# EAGLE design droneMaster (EAGLE 9.0.0)
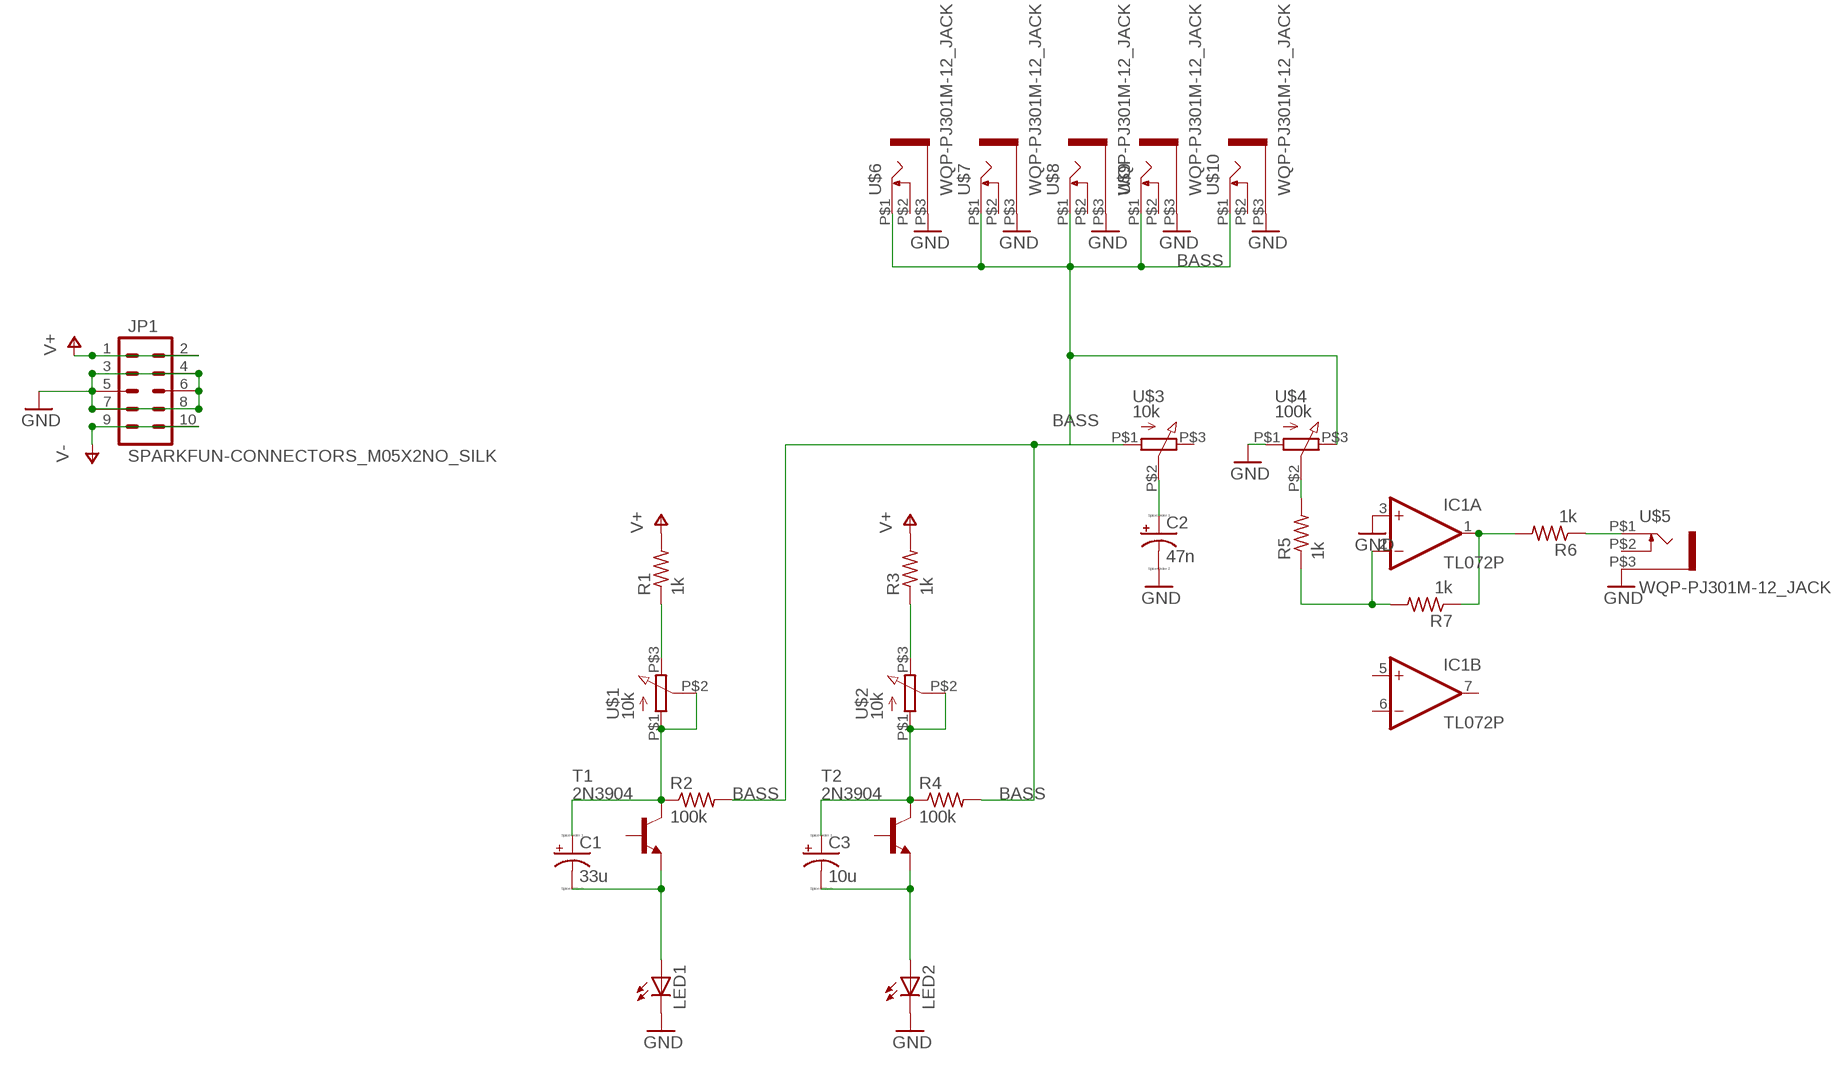
[diagram p0: schematic, sheet 1]

## Parts
C1  33u  CPOL-USE2.5-7  [E2,5-7]
C2  47n  CPOL-USE2.5-7  [E2,5-7]
C3  10u  CPOL-USE2.5-7  [E2,5-7]
IC1  TL072P  [DIL08]
JP1  SPARKFUN-CONNECTORS_M05X2NO_SILK  [SPARKFUN-CONNECTORS_2X5_NOSILK]
LED1  LED5MM  [LED5MM]
LED2  LED5MM  [LED5MM]
R1  1k  R-US_0204/7  [0204/7]
R2  100k  R-US_0204/7  [0204/7]
R3  1k  R-US_0204/7  [0204/7]
R4  100k  R-US_0204/7  [0204/7]
R5  1k  R-US_0204/7  [0204/7]
R6  1k  R-US_0204/7  [0204/7]
R7  1k  R-US_0204/7  [0204/7]
T1  2N3904  [TO92]
T2  2N3904  [TO92]
U$1  10k  INSTRUO_Q-POT  [INSTRUO_Q-POT]
U$2  10k  INSTRUO_Q-POT  [INSTRUO_Q-POT]
U$3  10k  INSTRUO_Q-POT  [INSTRUO_Q-POT]
U$4  100k  INSTRUO_Q-POT  [INSTRUO_Q-POT]
U$5  WQP-PJ301M-12_JACK  [WQP-PJ301M-12_JACK]
U$6  WQP-PJ301M-12_JACK  [WQP-PJ301M-12_JACK]
U$7  WQP-PJ301M-12_JACK  [WQP-PJ301M-12_JACK]
U$8  WQP-PJ301M-12_JACK  [WQP-PJ301M-12_JACK]
U$9  WQP-PJ301M-12_JACK  [WQP-PJ301M-12_JACK]
U$10  WQP-PJ301M-12_JACK  [WQP-PJ301M-12_JACK]

## Nets
BASS: R2.2 R4.2 U$3.P$1 U$4.P$3 U$6.P$1 U$7.P$1 U$8.P$1 U$9.P$1 U$10.P$1
GND: C2.- IC1.3(A:+IN) JP1.3 JP1.4 JP1.5 JP1.6 JP1.7 JP1.8 LED1.K(C) LED2.K(C) U$4.P$1 U$5.P$3 U$6.P$3 U$7.P$3 U$8.P$3 U$9.P$3 U$10.P$3
N$1: R1.1 U$1.P$3
N$2: C1.+ R2.1 T1.1(C) U$1.P$1 U$1.P$2
N$3: C1.- LED1.A T1.3(E)
N$5: R3.1 U$2.P$3
N$6: C3.+ R4.1 T2.1(C) U$2.P$1 U$2.P$2
N$7: C3.- LED2.A T2.3(E)
N$8: C2.+ U$3.P$2
N$9: R5.2 U$4.P$2
N$10: IC1.1(A:OUT) R6.2 R7.1
N$11: IC1.2(A:-IN) R5.1 R7.2
N$12: R6.1 U$5.P$1
V+: JP1.1 JP1.2 R1.2 R3.2
V-: JP1.9 JP1.10
Unconnected: IC1.5(B:+IN) IC1.6(B:-IN) IC1.7(B:OUT) T1.2(B) T2.2(B) U$3.P$3 U$5.P$2 U$6.P$2 U$7.P$2 U$8.P$2 U$9.P$2 U$10.P$2

## Power pins joined to a net without a drawn wire
V+: IC1.8(P:V+)
V-: IC1.4(P:V-)

## Library data of the parts
C1-C3 = resistor:CPOL-US: POLARIZED CAPACITOR, American symbol
IC1 = linear:TL072: OP AMP
JP1 = Pure_VCO_SMD_V2_2:SPARKFUN-CONNECTORS_M05X2: Header 5x2 Standard 10-pin dual row 0.1" header. Commonly used with AVR-ISP. Use with Spark Fun Electronics SKU: PRT-00778
LED1 LED2 = led:LED: LED OSRAM: - CHIPLED LG R971, LG N971, LY N971, LG Q971, LY Q971, LO R971, LY R971 LH N974, LH R974 LS Q976, LO Q976, LY Q976 LO Q996 - Hyper CHIPLED LW Q18S LB Q993, LB Q99A, LB R99A - SideLED LS A670, LO A670, LY A670, LG A670, LP A670 LB A673, LV A673, LT A673, LW A673 LH A674 LY A675 LS A676, LA A676, LO A676, LY A676, LW A676 LS A679, LY A679, LG A679 - Hyper Micro SIDELED® LS Y876, LA Y876, LO Y876, LY Y876 LT Y87S - SmartLED LW L88C, LW L88S LB L89C, LB L89S, LG L890 LS L89K, LO L89K, LY L89K LS L896, LA L896, LO L896, LY L896 - TOPLED LS T670, LO T670, LY T670, LG T670, LP T670 LSG T670, LSP T670, LSY T670, LOP T670, LYG T670 LG T671, LOG T671, LSG T671 LB T673, LV T673, LT T673, LW T673 LH T674 LS T676, LA T676, LO T676, LY T676, LB T676, LH T676, LSB T676, LW T676 LB T67C, LV T67C, LT T67C, LS T67K, LO T67K, LY T67K, LW E67C LS E67B, LA E67B, LO E67B, LY E67B, LB E67C, LV E67C, LT E67C LW T67C LS T679, LY T679, LG T679 LS T770, LO T770, LY T770, LG T770, LP T770 LB T773, LV T773, LT T773, LW T773 LH T774 LS E675, LA E675, LY E675, LS T675 LS T776, LA T776, LO T776, LY T776, LB T776 LHGB T686 LT T68C, LB T68C - Hyper Mini TOPLED® LB M676 - Mini TOPLED Santana® LG M470 LS M47K, LO M47K, LY M47K Source: http://www.osram.convergy.de LUXEON: - LUMILED® LXK2-PW12-R00, LXK2-PW12-S00, LXK2-PW14-U00, LXK2-PW14-V00 LXK2-PM12-R00, LXK2-PM12-S00, LXK2-PM14-U00 LXK2-PE12-Q00, LXK2-PE12-R00, LXK2-PE12-S00, LXK2-PE14-T00, LXK2-PE14-U00 LXK2-PB12-K00, LXK2-PB12-L00, LXK2-PB12-M00, LXK2-PB14-N00, LXK2-PB14-P00, LXK2-PB14-Q00 LXK2-PR12-L00, LXK2-PR12-M00, LXK2-PR14-Q00, LXK2-PR14-R00 LXK2-PD12-Q00, LXK2-PD12-R00, LXK2-PD12-S00 LXK2-PH12-R00, LXK2-PH12-S00 LXK2-PL12-P00, LXK2-PL12-Q00, LXK2-PL12-R00 Source: www.luxeon.com KINGBRIGHT: KA-3528ASYC Source: www.kingbright.com
R1-R7 = resistor:R-US_: RESISTOR, American symbol
T1 T2 = transistor:2N3904: NPN TRANSISTOR
U$1-U$4 = Pure_VCO_SMD_V2_2:INSTRUO_Q-POT
U$5-U$10 = thonkiconn:WQP-PJ301M-12_JACK

## Board
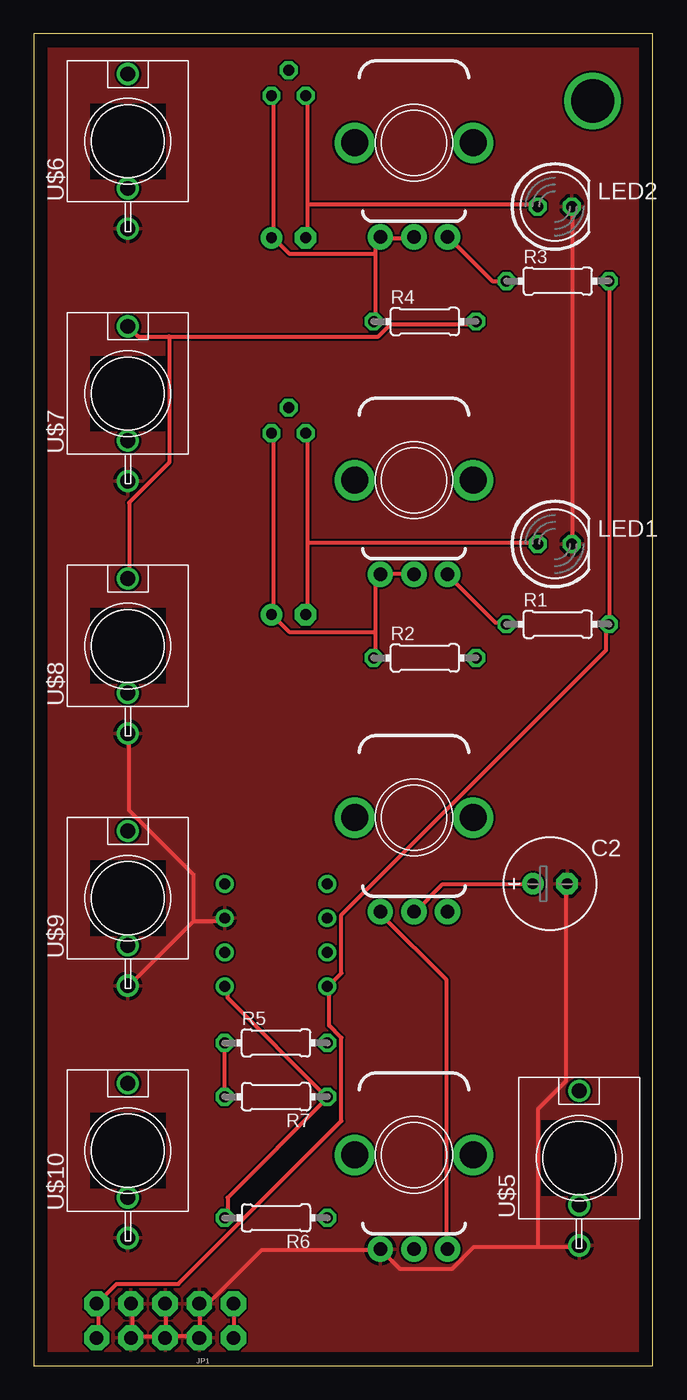
[diagram p1: board, top side]
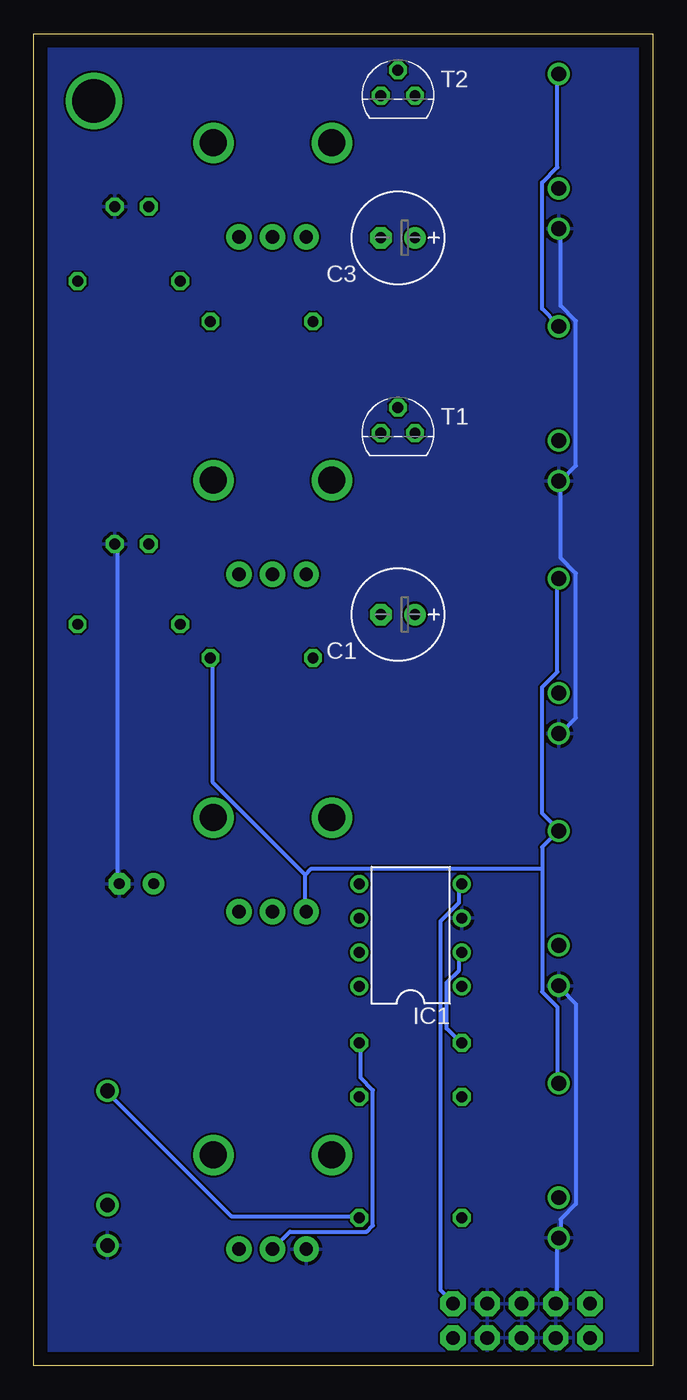
[diagram p2: board, bottom side, seen from below]

Size 46 x 99 mm. Coordinates in mm from the lower left corner, seen from the top.
Outline: 0,0 46,0 46,99 0,99 0,0
Copper layers (1*16): Top 0.035mm / dielectric 1.5mm / Bottom 0.035mm
Design rules "default *": minimum track width 12mil, minimum drill 0.35mm, track to track 6mil, track to pad 6mil, pad to pad 6mil, via to via 6mil, smd to smd 6mil, copper to edge 40mil, drill to drill 6mil, minimum pad ring 10mil, minimum via ring 8mil, stop-mask expansion 4mil, vias tented up to drill 0mil, thermal gap 10mil

### Footprints (pad centres in the part's own frame; a part is rotated, then mirrored left to right if it is on the bottom)
E2,5-7 = drill 0.813 pad 1.6: + -1.27,0 | drill 0.813 pad 1.6 octagon: - 1.27,0
DIL08 = drill 0.813 pad 1.27: 1 -3.81,-3.81; 2 -1.27,-3.81; 3 1.27,-3.81; 4 3.81,-3.81; 5 3.81,3.81; 6 1.27,3.81; 7 -1.27,3.81; 8 -3.81,3.81
SPARKFUN-CONNECTORS_2X5_NOSILK = drill 1.016 pad 1.88 octagon: 1 -1.27,5.08; 2 1.27,5.08; 3 -1.27,2.54; 4 1.27,2.54; 5 -1.27,0; 6 1.27,0; 7 -1.27,-2.54; 8 1.27,-2.54; 9 -1.27,-5.08; 10 1.27,-5.08
LED5MM = drill 0.813 octagon: A -1.27,0; K 1.27,0
0204/7 = drill 0.813 octagon: 1 -3.81,0; 2 3.81,0
TO92 = drill 0.813 octagon: 1 1.27,0; 2 0,1.905; 3 -1.27,0
INSTRUO_Q-POT = drill 1 pad 1.88: P$1 -2.5,-7; P$2 0,-7; P$3 2.5,-7 | drill 2 pad 2.68: P$4 -4.4,0; P$5 4.4,0
WQP-PJ301M-12_JACK = drill 1.1: P$1 0,5; P$2 0,-3.5; P$3 0,-6.5

### Placement (x,y rotation side)
C1  18.94,55.83 180 bottom
C2  38.36,35.83 0 top
C3  18.94,83.83 180 bottom
IC1  18,32 90 bottom
JP1  9.76,3.35 90 top
LED1  38.71,61.08 0 top
LED2  38.71,86.15 0 top
R1  38.93,55.11 0 top
R2  29.06,52.61 0 top
R3  38.93,80.61 0 top
R4  29.06,77.61 0 top
R5  18,24 0 top
R6  18,11 180 top
R7  18,20 180 top
T1  18.94,69.31 0 bottom
T2  18.94,94.38 0 bottom
U$1  28.25,65.82 0 top
U$2  28.25,90.89 0 top
U$3  28.25,40.74 0 top
U$4  28.25,15.67 0 top
U$5  40.52,15.44 0 top
U$6  7,91 0 top
U$7  7,72.25 0 top
U$8  7,53.5 0 top
U$9  7,34.75 0 top
U$10  7,16 0 top

### Tracks (layer width: path | path; a pad name or v marks a point on that pad's centre or on a via)
BASS
  Top 0.305: 10.06,76.5 7.77,76.5 7.09,77.18 U$7.P$1 | 10.06,76.5 25.6,76.5 26.52,77.41 32.69,77.41 R4.2 | 10.06,76.5 10.06,67.12 7.09,64.15 7.09,58.66 U$8.P$1 | U$4.P$3 30.63,8.83 30.63,28.72 25.83,33.52 U$3.P$1
  Bottom 0.305: U$6.P$1 7.09,95.93 7.09,89.07 8.23,87.92 8.23,78.55 7.09,77.41 U$7.P$1 | 8.23,36.95 8.23,38.55 7.09,39.69 U$9.P$1 7.09,39.92 8.23,41.06 8.23,50.44 7.09,51.58 7.09,58.44 U$8.P$1 | 8.23,36.95 8.23,27.8 7.09,26.66 7.09,21.17 U$10.P$1 | 25.83,36.49 32.69,43.35 32.69,52.49 R2.2 | 25.83,36.49 25.83,33.75 U$3.P$1 | 8.23,36.95 25.38,36.95 25.83,36.49
GND
  Top 0.305: LED1.K 40.01,61.18 40.01,86.1 LED2.K | 9.83,2.2 9.83,4.49 JP1.6 | 9.83,2.2 12.12,2.2 JP1.7 12.34,2.2 12.34,4.49 JP1.8 12.34,4.71 13.03,4.71 16.92,8.6 25.6,8.6 U$4.P$1 25.83,8.6 27.2,7.23 31.09,7.23 32.69,8.83 37.49,8.83 | 9.83,2.2 JP1.5 9.6,2.2 7.32,2.2 | 7.32,2.2 7.32,4.49 JP1.4 | 7.32,2.2 JP1.3 | 37.49,8.83 40.46,8.83 U$5.P$3 | 11.89,33.06 14.17,33.06 IC1.3 | 11.89,33.06 7.09,28.26 U$9.P$3 | 11.89,33.06 11.89,36.49 7.09,41.29 7.09,46.78 U$8.P$3 | 37.49,8.83 37.49,19.12 39.55,21.17 39.55,35.8 C2.-
  Bottom 0.305: C2.- 39.78,36.03 39.78,60.95 LED1.K | JP1.4 7.09,4.71 7.09,9.29 U$10.P$3 6.86,9.52 6.86,10.89 5.71,12.03 5.71,26.89 6.86,28.03 U$9.P$3 | U$8.P$3 6.86,47.01 5.71,48.15 5.71,58.89 6.86,60.04 6.86,65.52 U$7.P$3 6.86,65.75 5.71,66.89 5.71,77.64 6.86,78.78 6.86,84.5 U$6.P$3
  pour Top: 0,99 46,99 46,0 0,0
  pour Bottom: 0,99 46,99 46,0 0,0
N$1
  Top 0.305: R1.1 34.98,55.24 34.29,55.24 30.86,58.66 U$1.P$3
N$2
  Top 0.305: 25.38,54.55 25.38,58.44 25.6,58.66 U$1.P$1 25.83,58.89 28.12,58.89 U$1.P$2 | 25.38,54.55 25.38,52.72 R2.1 | T1.1 17.83,69.18 17.83,55.92 C1.+ 17.83,55.69 18.97,54.55 25.38,54.55
N$3
  Top 0.305: 20.34,61.18 20.34,55.92 C1.- | 20.34,61.18 20.34,69.18 T1.3 | 20.34,61.18 37.26,61.18 LED1.A
N$4  (via drill 3.2)
  other vias: 41.52,94
N$5
  Top 0.305: R3.1 34.98,80.61 34.06,80.61 30.86,83.81 U$2.P$3
N$6
  Top 0.305: 25.38,82.67 25.38,83.58 25.6,83.81 U$2.P$1 25.83,83.81 28.12,83.81 U$2.P$2 | 25.38,82.67 25.38,77.64 R4.1 | T2.1 17.83,94.33 17.83,84.04 C3.+ 17.83,83.81 18.97,82.67 25.38,82.67
N$7
  Top 0.305: 20.34,86.33 20.34,84.04 C3.- | 20.34,86.33 20.34,94.33 T2.3 | 20.34,86.33 37.26,86.33 LED2.A
N$8
  Top 0.305: C2.+ 37.03,35.8 30.4,35.8 28.35,33.75 U$3.P$2
N$9
  Bottom 0.305: R5.2 21.72,23.92 21.72,21.4 20.8,20.49 20.8,10.43 21.26,9.97 26.98,9.97 28.12,8.83 U$4.P$2
N$10
  Top 0.305: R6.2 14.4,11.12 14.4,12.49 21.72,19.8 R7.1 21.72,20.03 14.4,27.35 14.4,28.03 IC1.1
N$11
  Top 0.305: R7.2 14.17,20.03 14.17,23.92 R5.1
  Bottom 0.305: IC1.2 14.4,30.55 14.4,29.4 15.32,28.49 15.32,25.06 14.4,24.15 R5.1
N$12
  Bottom 0.305: R6.1 21.95,11.12 31.32,11.12 40.46,20.26 U$5.P$1
V+
  Top 0.305: R3.2 42.75,80.38 42.75,55.24 R1.2 42.52,55.01 42.52,53.18 22.86,33.52 22.86,29.18 21.95,28.26 IC1.8 21.95,28.03 21.95,25.29 22.86,24.38 22.86,18.2 10.74,6.09 6.17,6.09 4.8,4.71 JP1.2 4.8,4.49 4.8,2.2 JP1.1
V-
  Top 0.305: JP1.9 14.86,2.2 14.86,4.49 JP1.10
  Bottom 0.305: IC1.4 14.4,35.8 14.4,34.43 15.77,33.06 15.77,5.63 14.86,4.71 JP1.10